# Altium schematic sheet 0062_DG2 DISPLAY - HDMI.SchDoc
size 848 x 558 mm
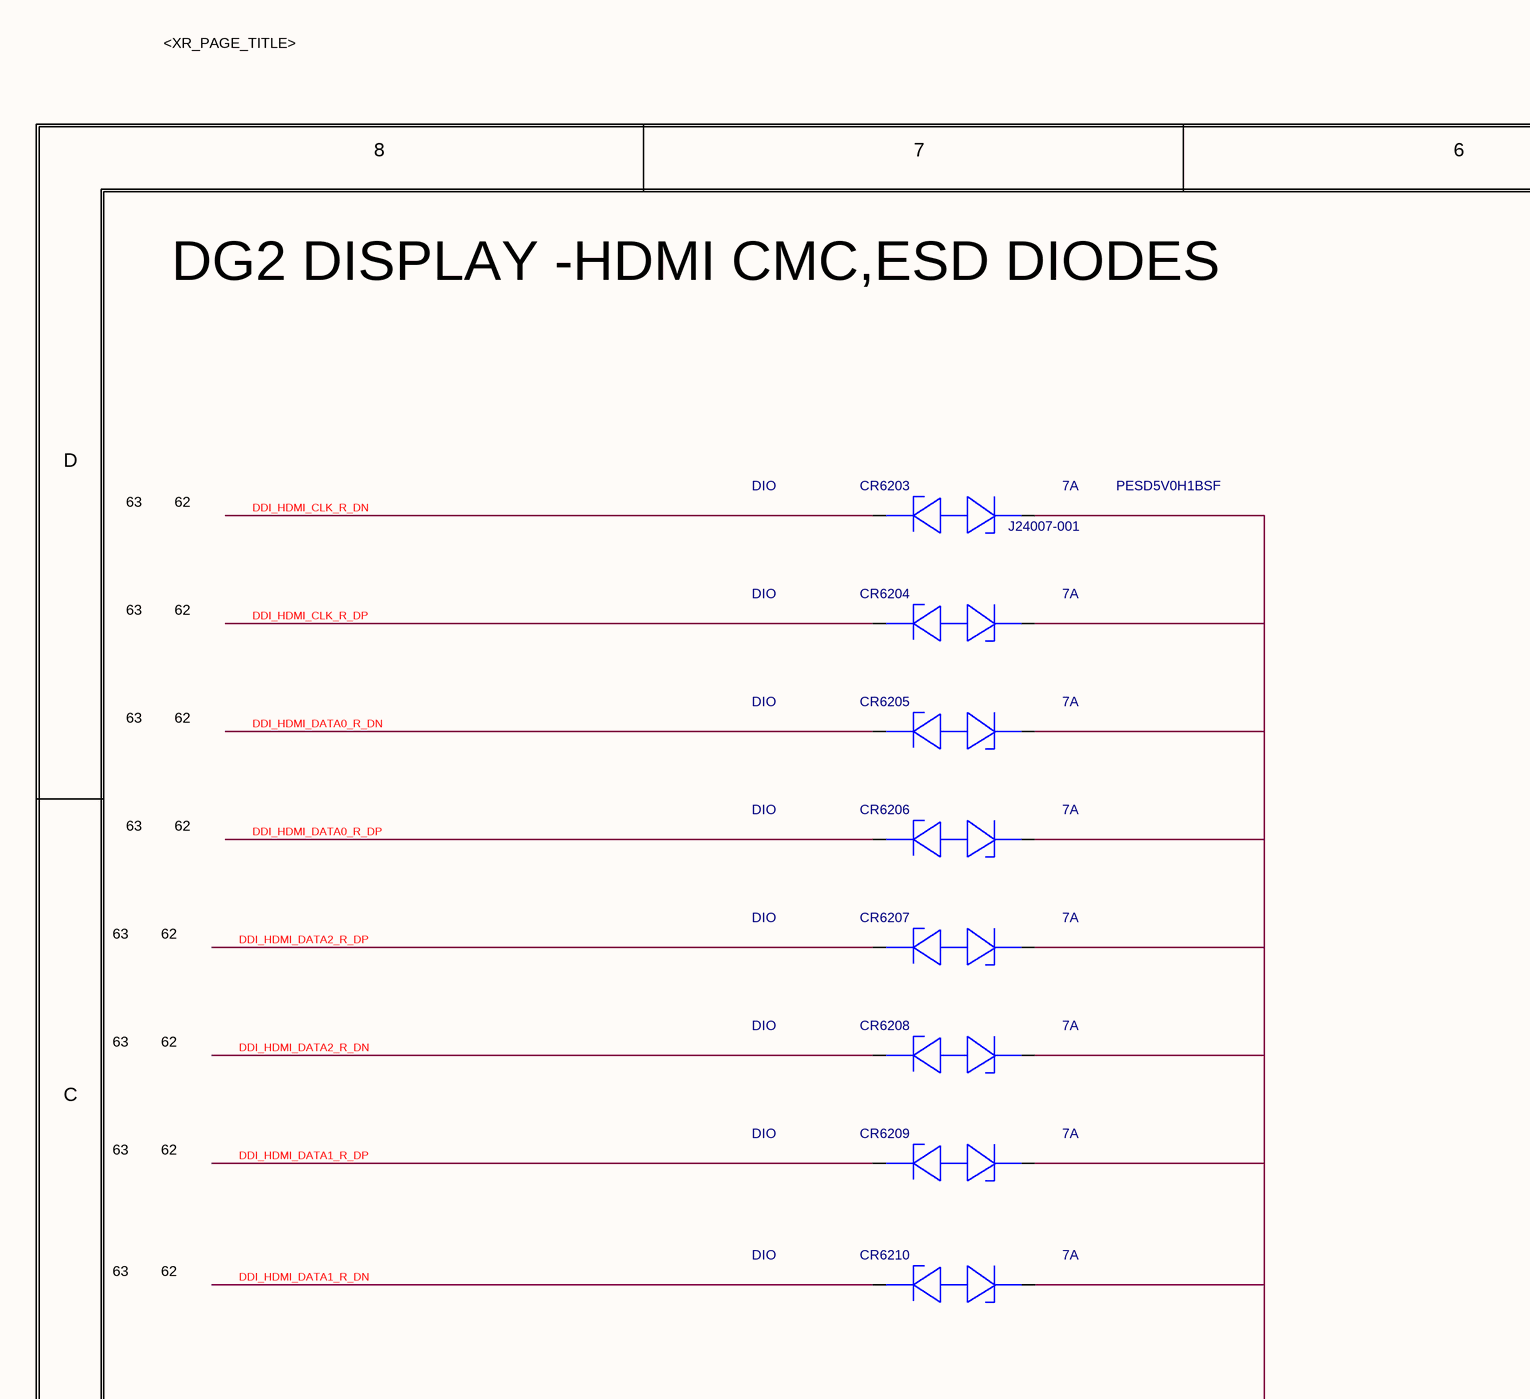
[diagram p0: 0062_DG2 DISPLAY - HDMI.SchDoc, top left]
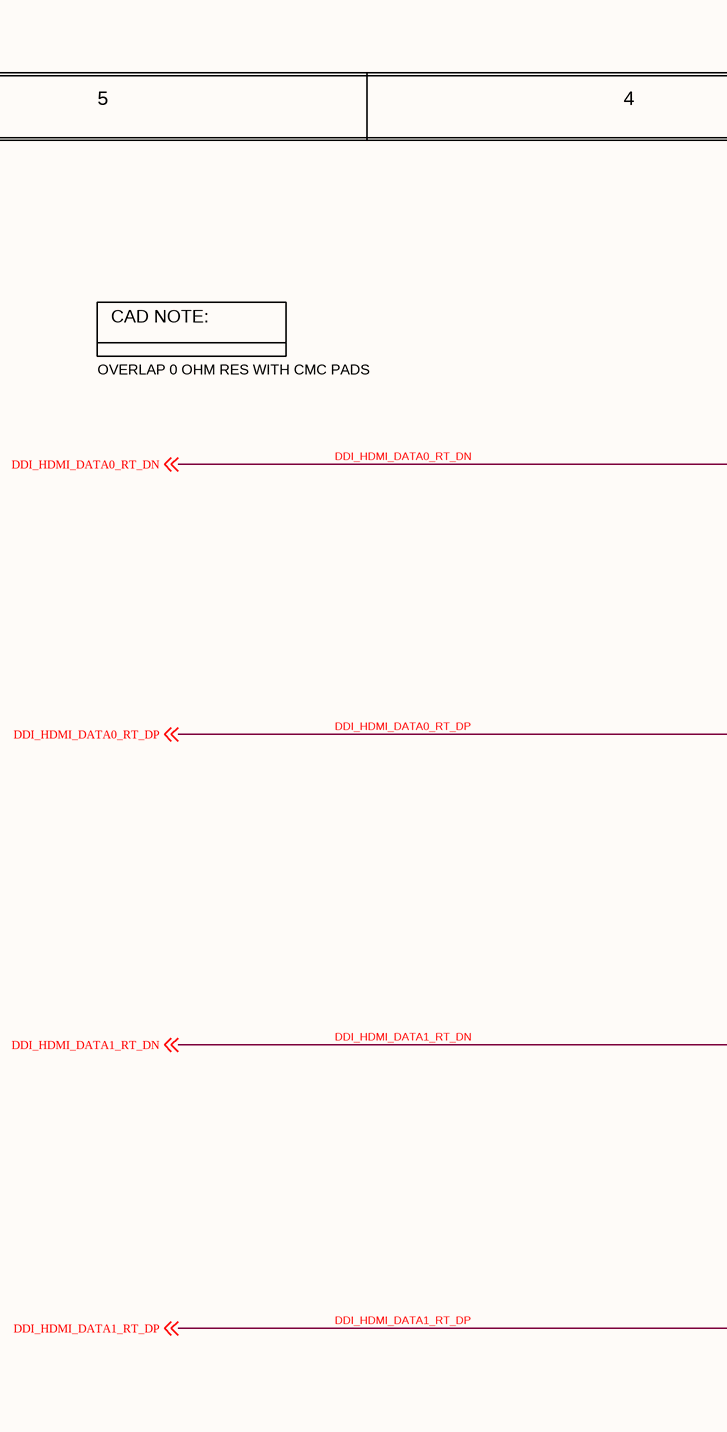
[diagram p1: 0062_DG2 DISPLAY - HDMI.SchDoc, top middle]
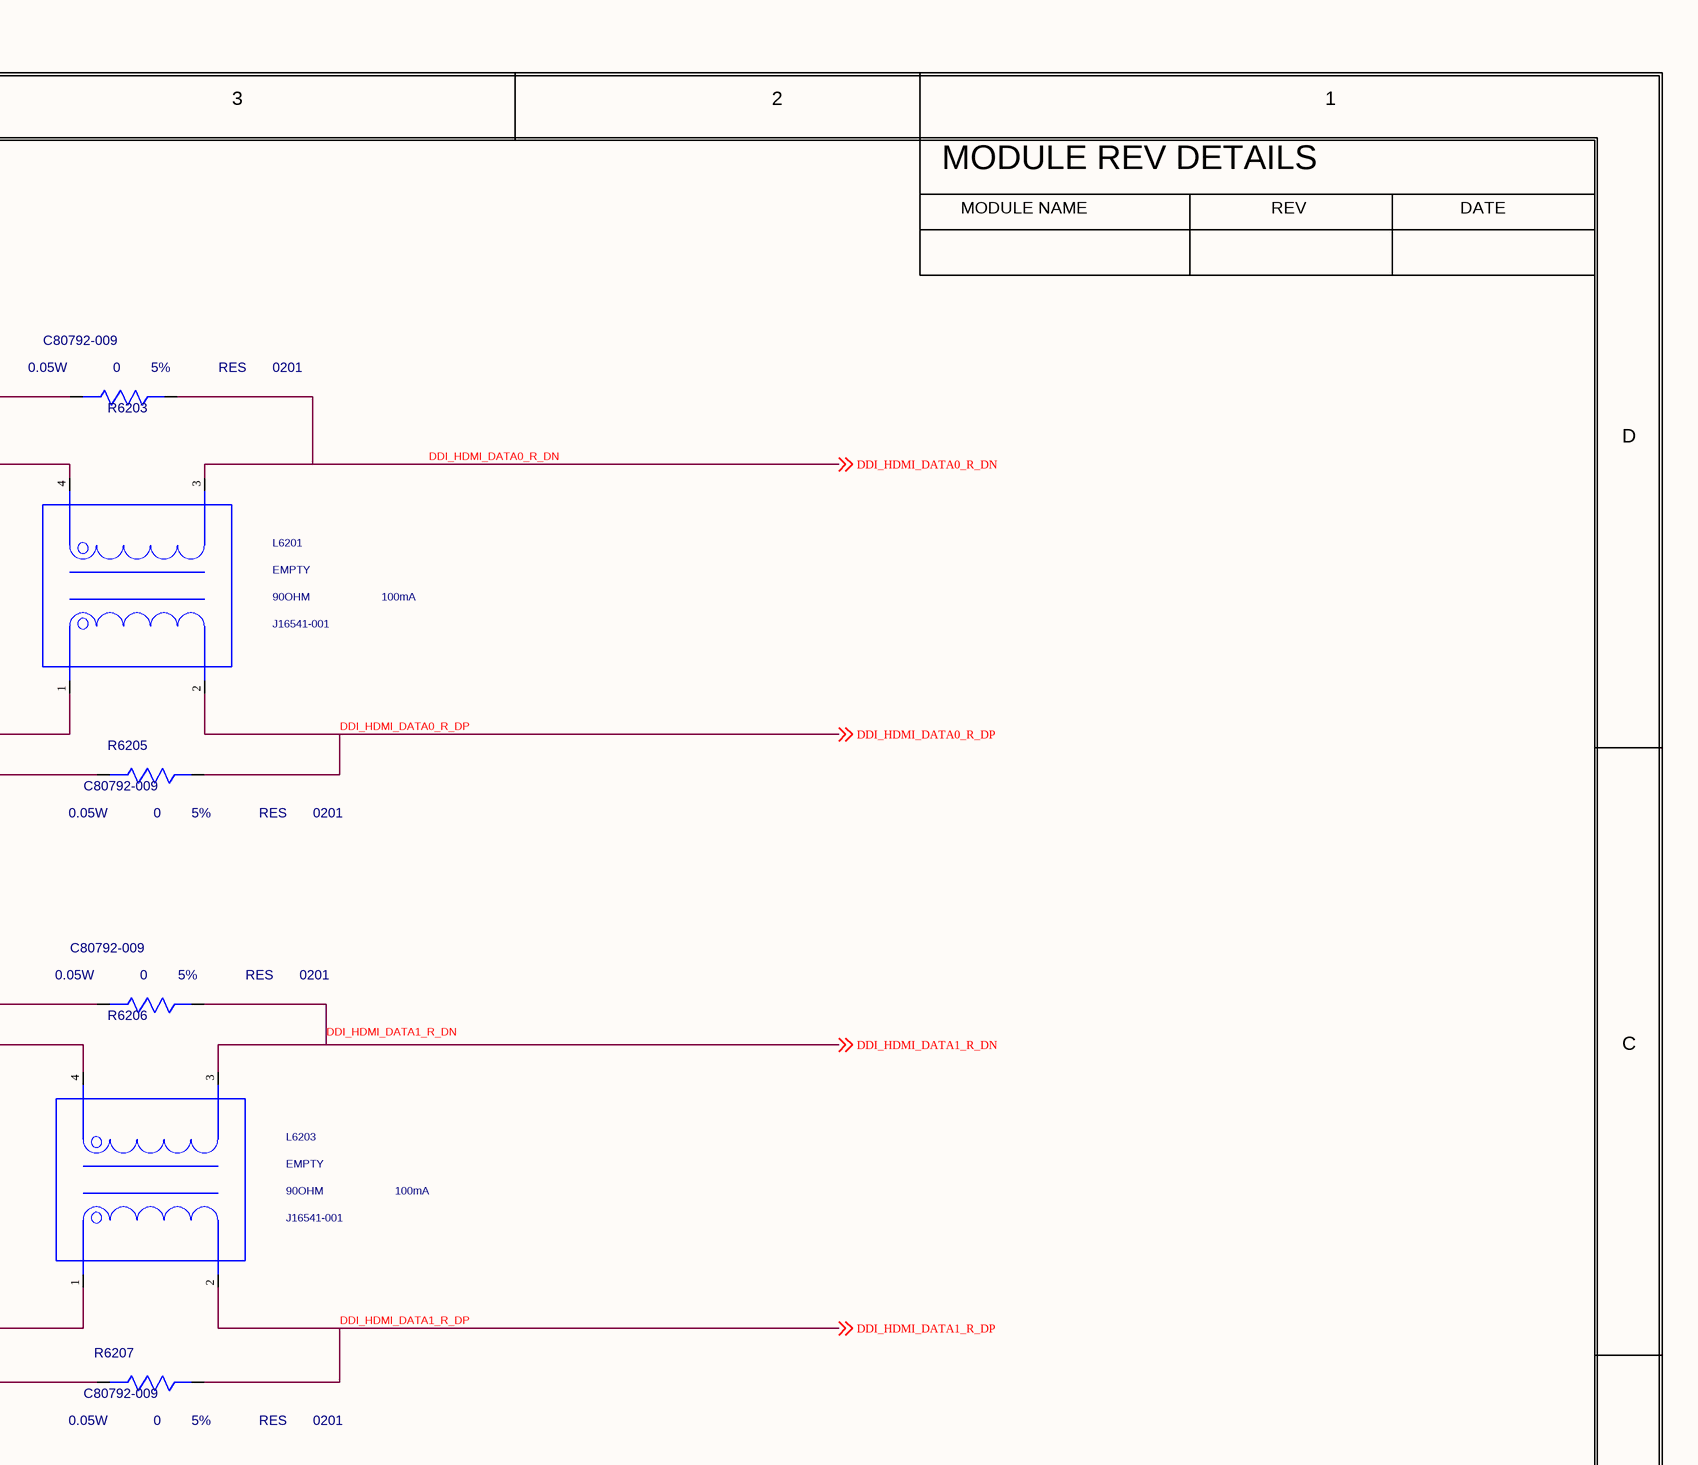
[diagram p2: 0062_DG2 DISPLAY - HDMI.SchDoc, top right]
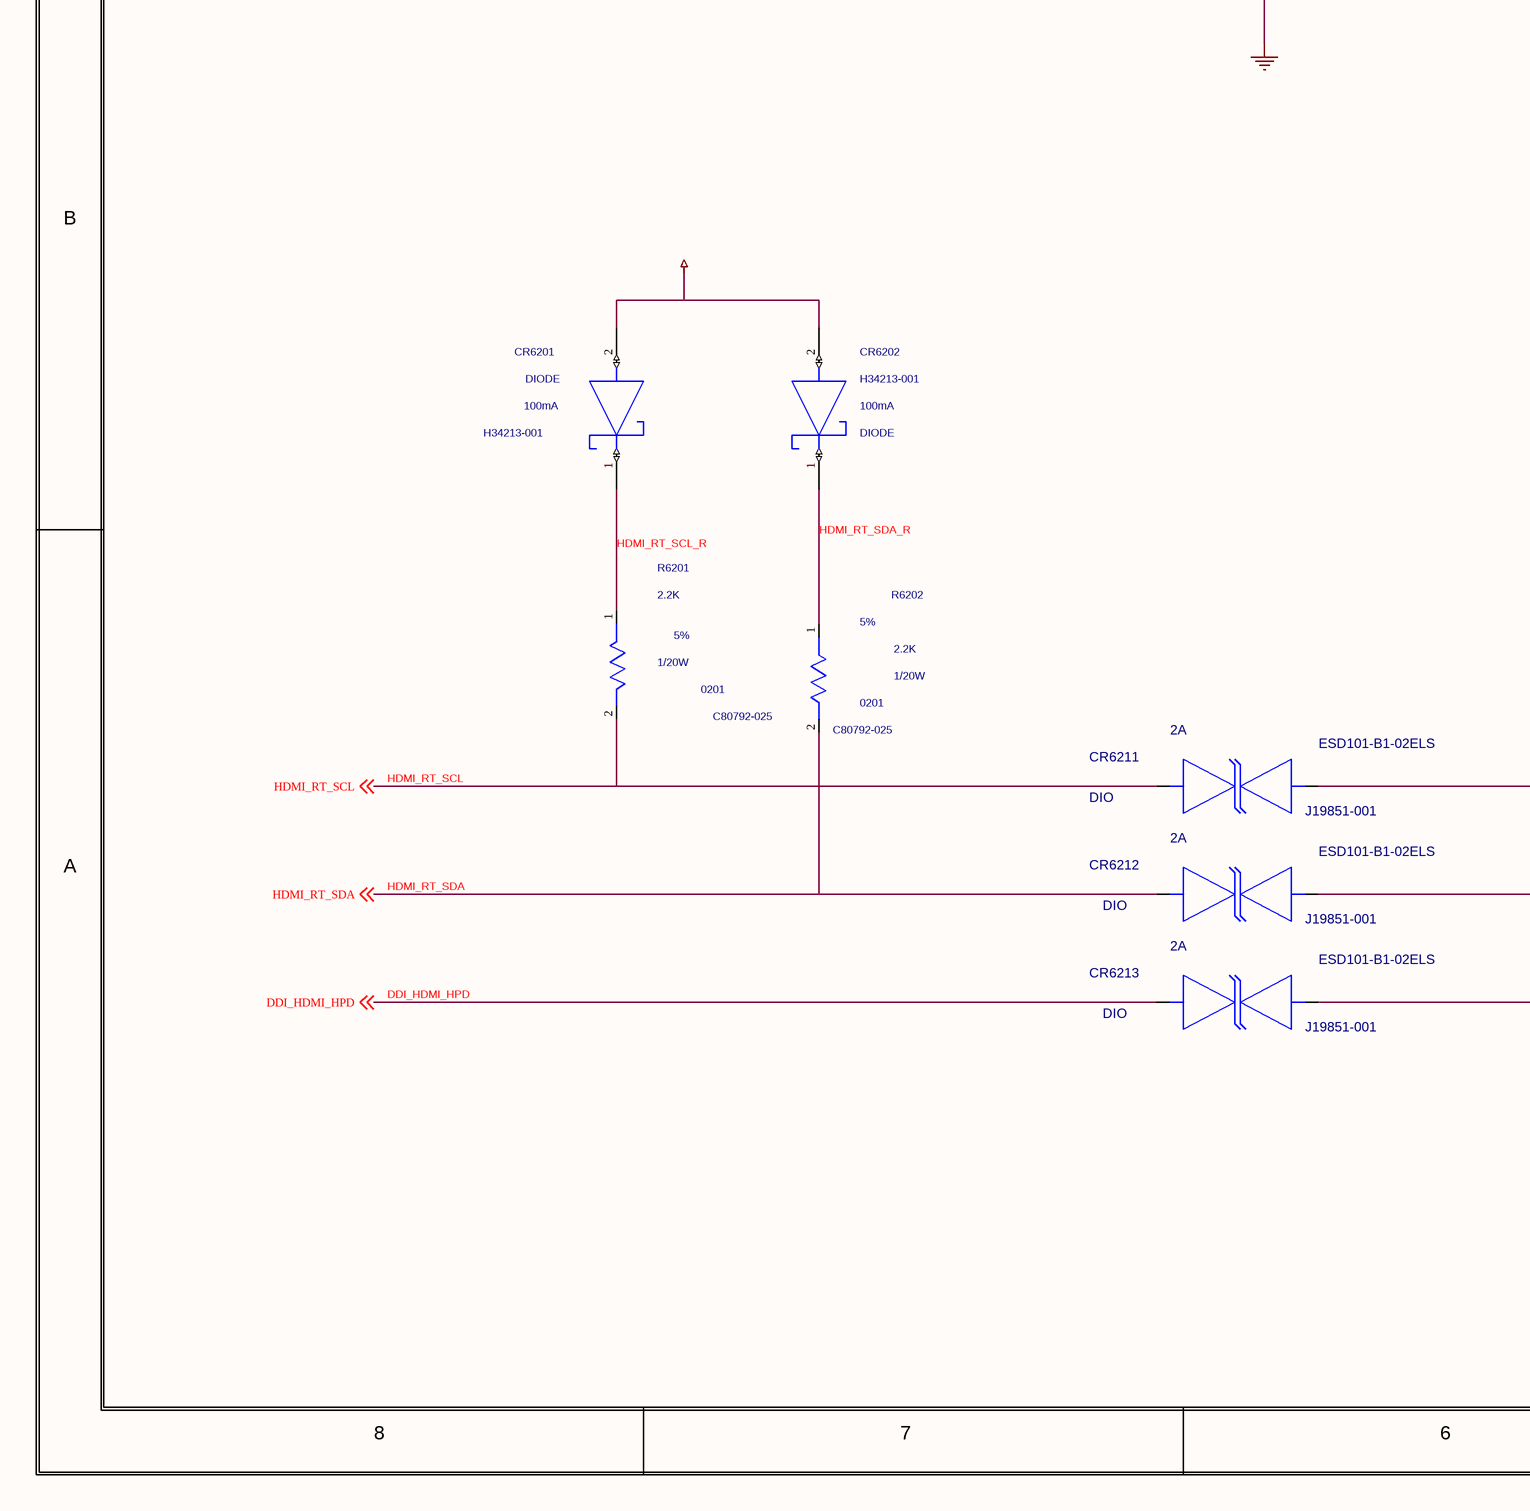
[diagram p3: 0062_DG2 DISPLAY - HDMI.SchDoc, bottom left]
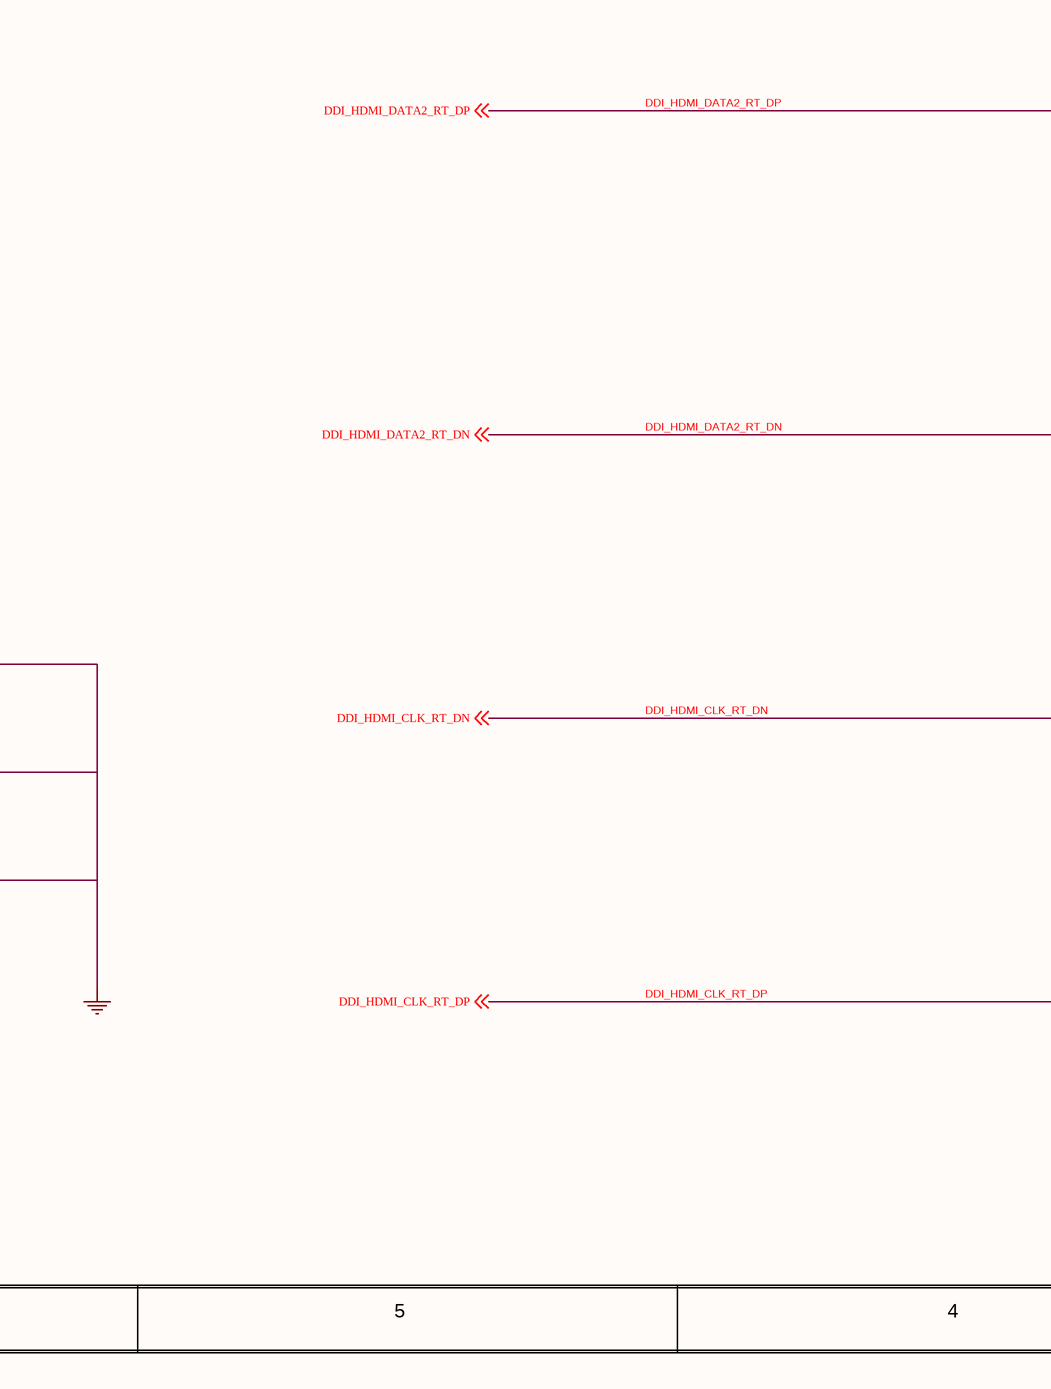
[diagram p4: 0062_DG2 DISPLAY - HDMI.SchDoc, bottom middle]
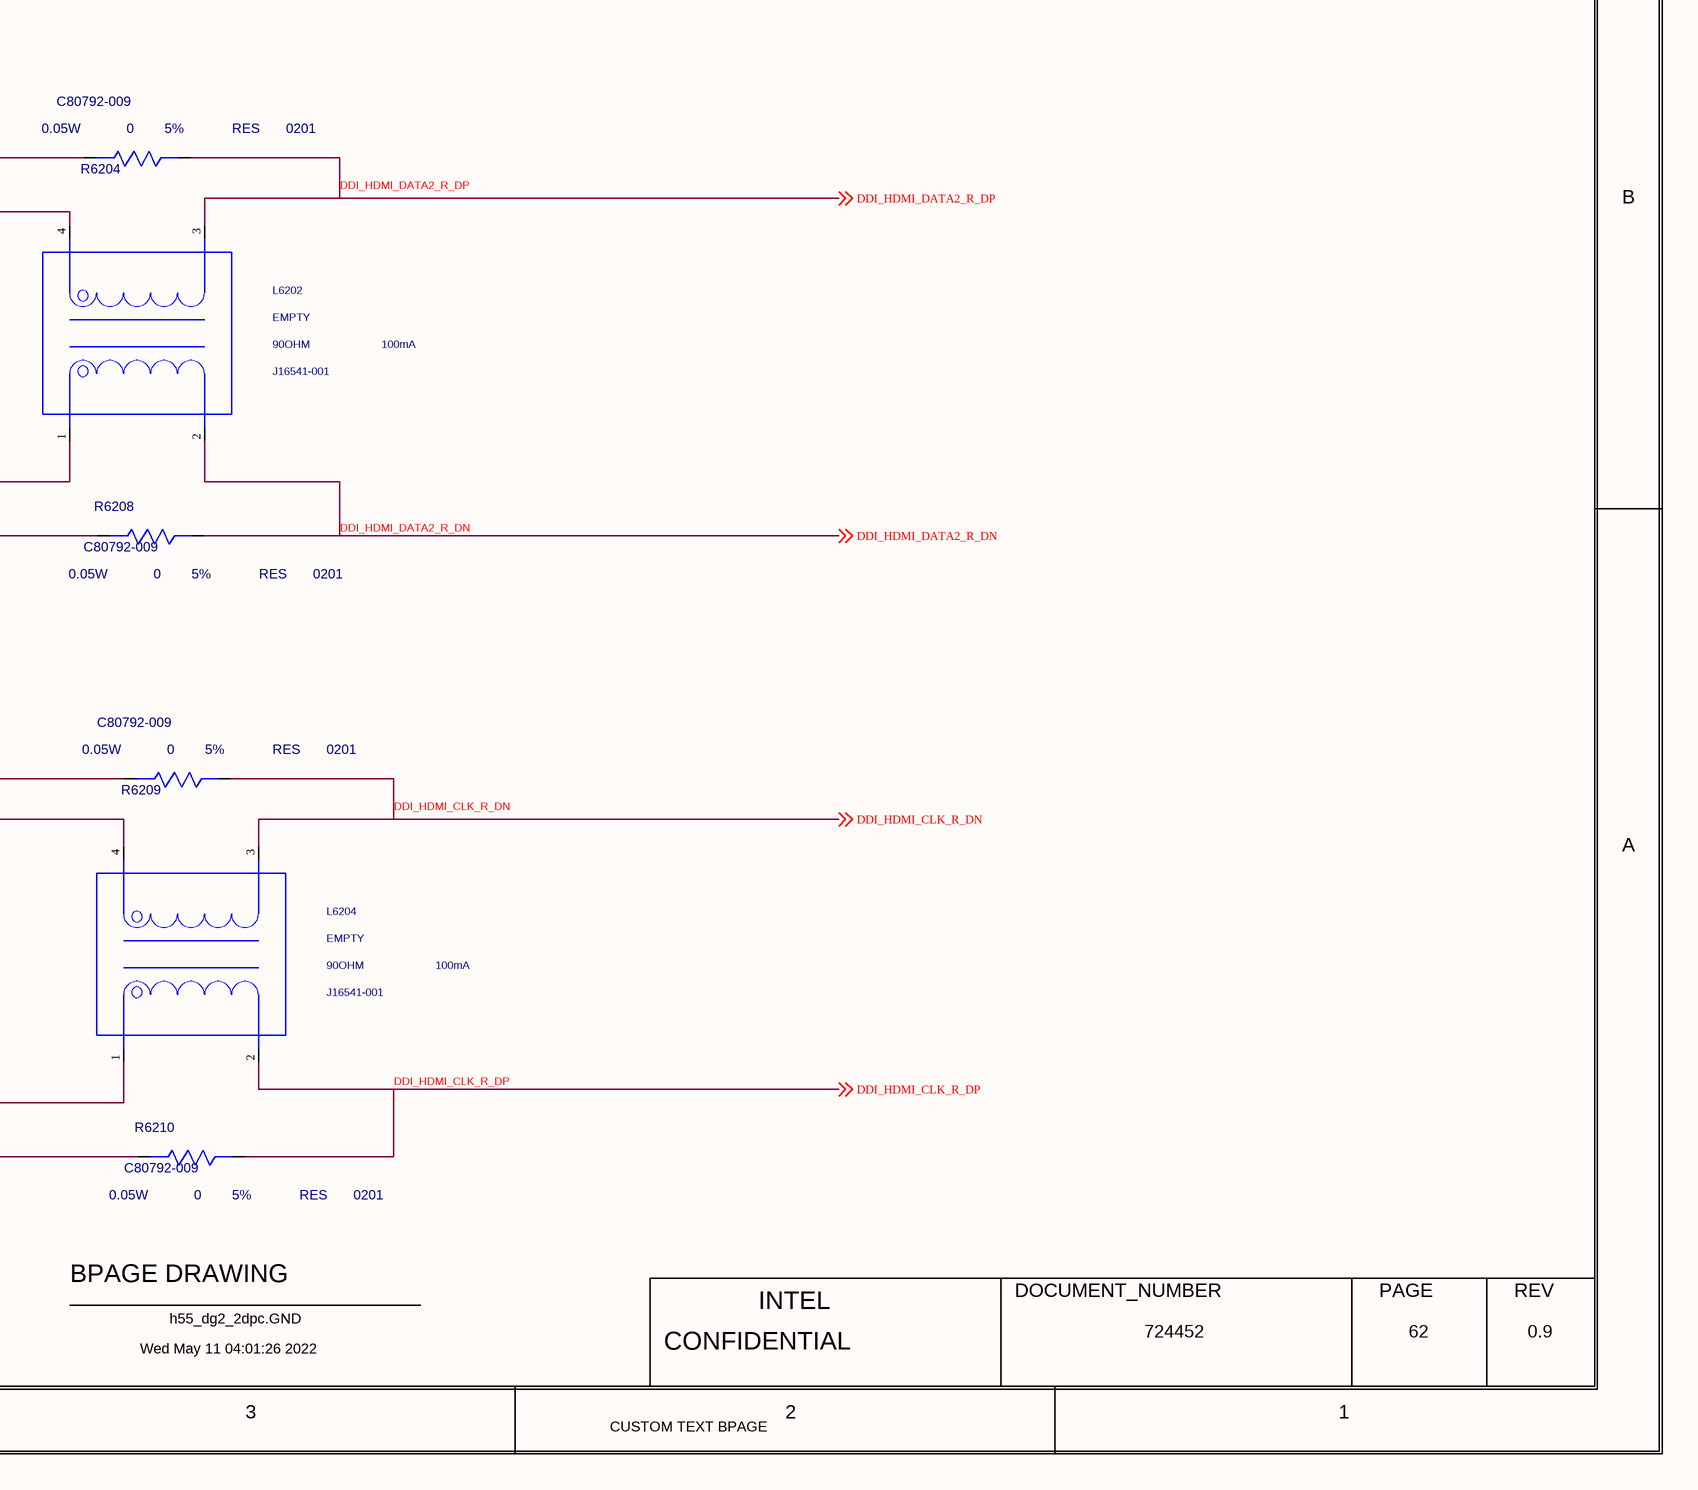
[diagram p5: 0062_DG2 DISPLAY - HDMI.SchDoc, bottom right]

## Parts
CR6201  CURRENT: 100mA  MATERIAL: DIODE  PART_NUMBER: H34213-001  [SOD923MA]  (hidden comment: RB521C30-2/TR)
CR6202  CURRENT: 100mA  MATERIAL: DIODE  PART_NUMBER: H34213-001  [SOD923MA]  (hidden comment: RB521C30-2/TR)
CR6203  PESD5V0H1BSF  CURRENT: 7A  MATERIAL: DIO  PART_NUMBER: J24007-001  [CTK1_SCR_625X325_MA]
CR6204  CURRENT: 7A  MATERIAL: DIO  [CTK1_SCR_625X325_MA]  (hidden comment: PESD5V0H1BSF)
CR6205  CURRENT: 7A  MATERIAL: DIO  [CTK1_SCR_625X325_MA]  (hidden comment: PESD5V0H1BSF)
CR6206  CURRENT: 7A  MATERIAL: DIO  [CTK1_SCR_625X325_MA]  (hidden comment: PESD5V0H1BSF)
CR6207  CURRENT: 7A  MATERIAL: DIO  [CTK1_SCR_625X325_MA]  (hidden comment: PESD5V0H1BSF)
CR6208  CURRENT: 7A  MATERIAL: DIO  [CTK1_SCR_625X325_MA]  (hidden comment: PESD5V0H1BSF)
CR6209  CURRENT: 7A  MATERIAL: DIO  [CTK1_SCR_625X325_MA]  (hidden comment: PESD5V0H1BSF)
CR6210  CURRENT: 7A  MATERIAL: DIO  [CTK1_SCR_625X325_MA]  (hidden comment: PESD5V0H1BSF)
CR6211  ESD101-B1-02ELS  CURRENT: 2A  MATERIAL: DIO  PART_NUMBER: J19851-001  [CTK2_SCR0201_670X370_MB]
CR6212  ESD101-B1-02ELS  CURRENT: 2A  MATERIAL: DIO  PART_NUMBER: J19851-001  [CTK2_SCR0201_670X370_MB]
CR6213  ESD101-B1-02ELS  CURRENT: 2A  MATERIAL: DIO  PART_NUMBER: J19851-001  [CTK2_SCR0201_670X370_MB]
L6201  90OHM  CURRENT: 100mA  MATERIAL: EMPTY  PART_NUMBER: J16541-001  [SMI4_50X65MA]
L6202  90OHM  CURRENT: 100mA  MATERIAL: EMPTY  PART_NUMBER: J16541-001  [SMI4_50X65MA]
L6203  90OHM  CURRENT: 100mA  MATERIAL: EMPTY  PART_NUMBER: J16541-001  [SMI4_50X65MA]
L6204  90OHM  CURRENT: 100mA  MATERIAL: EMPTY  PART_NUMBER: J16541-001  [SMI4_50X65MA]
R6201  2.2K  PACK_TYPE: 0201  PART_NUMBER: C80792-025  TOLERANCE: 5%  WATTAGE: 1/20W  [SMR0201IA]
R6202  2.2K  PACK_TYPE: 0201  PART_NUMBER: C80792-025  TOLERANCE: 5%  WATTAGE: 1/20W  [SMR0201IA]
R6203  0  MATERIAL: RES  PACK_TYPE: 0201  PART_NUMBER: C80792-009  TOLERANCE: 5%  WATTAGE: 0.05W  [CTK0_SM0201_630X330_MA]
R6204  0  MATERIAL: RES  PACK_TYPE: 0201  PART_NUMBER: C80792-009  TOLERANCE: 5%  WATTAGE: 0.05W  [CTK0_SM0201_630X330_MA]
R6205  0  MATERIAL: RES  PACK_TYPE: 0201  PART_NUMBER: C80792-009  TOLERANCE: 5%  WATTAGE: 0.05W  [CTK0_SM0201_630X330_MA]
R6206  0  MATERIAL: RES  PACK_TYPE: 0201  PART_NUMBER: C80792-009  TOLERANCE: 5%  WATTAGE: 0.05W  [CTK0_SM0201_630X330_MA]
R6207  0  MATERIAL: RES  PACK_TYPE: 0201  PART_NUMBER: C80792-009  TOLERANCE: 5%  WATTAGE: 0.05W  [CTK0_SM0201_630X330_MA]
R6208  0  MATERIAL: RES  PACK_TYPE: 0201  PART_NUMBER: C80792-009  TOLERANCE: 5%  WATTAGE: 0.05W  [CTK0_SM0201_630X330_MA]
R6209  0  MATERIAL: RES  PACK_TYPE: 0201  PART_NUMBER: C80792-009  TOLERANCE: 5%  WATTAGE: 0.05W  [CTK0_SM0201_630X330_MA]
R6210  0  MATERIAL: RES  PACK_TYPE: 0201  PART_NUMBER: C80792-009  TOLERANCE: 5%  WATTAGE: 0.05W  [CTK0_SM0201_630X330_MA]

## Nets
+V5A_HDMI_DDIB: CR6201.2(ANODE) CR6202.2(ANODE)
GND: CR6203.2(K2) CR6204.2(K2) CR6205.2(K2) CR6206.2(K2) CR6207.2(K2) CR6208.2(K2) CR6209.2(K2) CR6210.2(K2) CR6211.2(A2) CR6212.2(A2) CR6213.2(A2)
DDI_HDMI_CLK_R_DN: CR6203.1(K1) L6204.3(PIN3) R6209.2(B) ; off-sheet DDI_HDMI_CLK_R_DN
DDI_HDMI_CLK_R_DP: CR6204.1(K1) L6204.2(PIN2) R6210.2(B) ; off-sheet DDI_HDMI_CLK_R_DP
DDI_HDMI_CLK_RT_DN: L6204.4(PIN4) R6209.1(A) ; off-sheet DDI_HDMI_CLK_RT_DN
DDI_HDMI_CLK_RT_DP: L6204.1(PIN1) R6210.1(A) ; off-sheet DDI_HDMI_CLK_RT_DP
DDI_HDMI_DATA0_R_DN: CR6205.1(K1) L6201.3(PIN3) R6203.2(B) ; off-sheet DDI_HDMI_DATA0_R_DN
DDI_HDMI_DATA0_R_DP: CR6206.1(K1) L6201.2(PIN2) R6205.2(B) ; off-sheet DDI_HDMI_DATA0_R_DP
DDI_HDMI_DATA0_RT_DN: L6201.4(PIN4) R6203.1(A) ; off-sheet DDI_HDMI_DATA0_RT_DN
DDI_HDMI_DATA0_RT_DP: L6201.1(PIN1) R6205.1(A) ; off-sheet DDI_HDMI_DATA0_RT_DP
DDI_HDMI_DATA1_R_DN: CR6210.1(K1) L6203.3(PIN3) R6206.2(B) ; off-sheet DDI_HDMI_DATA1_R_DN
DDI_HDMI_DATA1_R_DP: CR6209.1(K1) L6203.2(PIN2) R6207.2(B) ; off-sheet DDI_HDMI_DATA1_R_DP
DDI_HDMI_DATA1_RT_DN: L6203.4(PIN4) R6206.1(A) ; off-sheet DDI_HDMI_DATA1_RT_DN
DDI_HDMI_DATA1_RT_DP: L6203.1(PIN1) R6207.1(A) ; off-sheet DDI_HDMI_DATA1_RT_DP
DDI_HDMI_DATA2_R_DN: CR6208.1(K1) L6202.2(PIN2) R6208.2(B) ; off-sheet DDI_HDMI_DATA2_R_DN
DDI_HDMI_DATA2_R_DP: CR6207.1(K1) L6202.3(PIN3) R6204.2(B) ; off-sheet DDI_HDMI_DATA2_R_DP
DDI_HDMI_DATA2_RT_DN: L6202.1(PIN1) R6208.1(A) ; off-sheet DDI_HDMI_DATA2_RT_DN
DDI_HDMI_DATA2_RT_DP: L6202.4(PIN4) R6204.1(A) ; off-sheet DDI_HDMI_DATA2_RT_DP
DDI_HDMI_HPD: CR6213.1(A1) ; off-sheet DDI_HDMI_HPD
HDMI_RT_SCL: CR6211.1(A1) R6201.2(B) ; off-sheet HDMI_RT_SCL
HDMI_RT_SCL_R: CR6201.1(CATHODE) R6201.1(A)
HDMI_RT_SDA: CR6212.1(A1) R6202.2(B) ; off-sheet HDMI_RT_SDA
HDMI_RT_SDA_R: CR6202.1(CATHODE) R6202.1(A)

## Notes on the sheet
- <XR_PAGE_TITLE>
- 8
- 7
- 6
- 5
- 4
- 3
- 2
- 1
- MODULE REV DETAILS
- DG2 DISPLAY -HDMI CMC,ESD DIODES
- MODULE NAME
- REV
- DATE
- CAD NOTE:
- OVERLAP 0 OHM RES WITH CMC PADS
- D
- 63
- 62
- C
- B
- A
- BPAGE DRAWING
- INTEL
- DOCUMENT_NUMBER
- PAGE
- Wed May 11 04:01:26 2022
- h55_dg2_2dpc.GND
- CONFIDENTIAL
- 724452
- 0.9
- CUSTOM TEXT BPAGE

## Library data of the parts
CR6201 = DIODE_SCHOTTKY: CDS_PHYS_PART_NAME: DIODE_SCHOTTKY_SM-H34213-001,DIODE,RB521C30-2/TR,100MA,LPDB,GENA; CDS_LMAN_SYM_OUTLINE: -50,100,50,-100; PACK_TYPE: SM; OriginalSymbolOrigin: (-75,50); XY: (-3300,1225); VER: 1; SUITE: ADL; SUB_ROOM: HDMI_DISCRETES; ROT: 3; ROOM1: HDMI; PHYS_PAGE: 62; LOCATION: CR6201; IP: GENERIC; FP_TECH: LPDB; DRAWING: @RVP1_ADL_SB_ADP_S_DDR5_SODIMM_2DPC_LIB.H55_DG2_2DPC(SCH_1):PAGE62; CONFIG: GENERAL; CDS_LIB: discrete; PCB Footprint: SOD923MA; CHIPS_PART_NAME: DIODE_SCHOTTKY; CDS_PART_NAME: DIODE_SCHOTTKY_SM-H34213-001,DIODE,RB521C30-2/TR,100MA,LPDB,GENA; CDS_LOCATION: CR6201
CR6202 = DIODE_SCHOTTKY: CDS_PHYS_PART_NAME: DIODE_SCHOTTKY_SM-H34213-001,DIODE,RB521C30-2/TR,100MA,LPDB,GENA; CDS_LMAN_SYM_OUTLINE: -50,100,50,-100; PACK_TYPE: SM; OriginalSymbolOrigin: (-75,50); XY: (-2925,1225); VER: 1; SUITE: ADL; SUB_ROOM: HDMI_DISCRETES; ROT: 3; ROOM1: HDMI; PHYS_PAGE: 62; LOCATION: CR6202; IP: GENERIC; FP_TECH: LPDB; DRAWING: @RVP1_ADL_SB_ADP_S_DDR5_SODIMM_2DPC_LIB.H55_DG2_2DPC(SCH_1):PAGE62; CONFIG: GENERAL; CDS_LIB: discrete; PCB Footprint: SOD923MA; CHIPS_PART_NAME: DIODE_SCHOTTKY; CDS_PART_NAME: DIODE_SCHOTTKY_SM-H34213-001,DIODE,RB521C30-2/TR,100MA,LPDB,GENA; CDS_LOCATION: CR6202
CR6203 = C_DIODE_ESD_BIDIR: CDS_PHYS_PART_NAME: C_DIODE_ESD_BIDIR_SM-J24007-001,DIO,PESD5V0H1BSF,7A,TK1,GENERIC; CDS_LMAN_SYM_OUTLINE: -100,50,100,-50; FP_TECH: TK1; IP: GENERIC; PACK_TYPE: SM; ROOM: NONE; OriginalSymbolOrigin: (-125,50); XY: (-2675,3775); VER: 1; ROT: 0; PHYS_PAGE: 62; LOCATION: CR6203; DRAWING: @RVP1_ADL_SB_ADP_S_DDR5_SODIMM_2DPC_LIB.H55_DG2_2DPC(SCH_1):PAGE62; CDS_LIB: local; VARIANT: ?; PCB Footprint: CTK1_SCR_625X325_MA; CHIPS_PART_NAME: C_DIODE_ESD_BIDIR; CDS_PART_NAME: C_DIODE_ESD_BIDIR_SM-J24007-001,DIO,PESD5V0H1BSF,7A,TK1,GENERIC; CDS_LOCATION: CR6203
CR6204 = C_DIODE_ESD_BIDIR: PART_NUMBER: J24007-001; CDS_PHYS_PART_NAME: C_DIODE_ESD_BIDIR_SM-J24007-001,DIO,PESD5V0H1BSF,7A,TK1,GENERIC; CDS_LMAN_SYM_OUTLINE: -100,50,100,-50; FP_TECH: TK1; IP: GENERIC; PACK_TYPE: SM; ROOM: NONE; OriginalSymbolOrigin: (-125,50); XY: (-2675,3575); VER: 1; ROT: 0; PHYS_PAGE: 62; LOCATION: CR6204; DRAWING: @RVP1_ADL_SB_ADP_S_DDR5_SODIMM_2DPC_LIB.H55_DG2_2DPC(SCH_1):PAGE62; CDS_LIB: local; VARIANT: ?; PCB Footprint: CTK1_SCR_625X325_MA; CHIPS_PART_NAME: C_DIODE_ESD_BIDIR; CDS_PART_NAME: C_DIODE_ESD_BIDIR_SM-J24007-001,DIO,PESD5V0H1BSF,7A,TK1,GENERIC; CDS_LOCATION: CR6204
CR6205 = C_DIODE_ESD_BIDIR: PART_NUMBER: J24007-001; CDS_PHYS_PART_NAME: C_DIODE_ESD_BIDIR_SM-J24007-001,DIO,PESD5V0H1BSF,7A,TK1,GENERIC; CDS_LMAN_SYM_OUTLINE: -100,50,100,-50; FP_TECH: TK1; IP: GENERIC; PACK_TYPE: SM; ROOM: NONE; OriginalSymbolOrigin: (-125,50); XY: (-2675,3375); VER: 1; ROT: 0; PHYS_PAGE: 62; LOCATION: CR6205; DRAWING: @RVP1_ADL_SB_ADP_S_DDR5_SODIMM_2DPC_LIB.H55_DG2_2DPC(SCH_1):PAGE62; CDS_LIB: local; VARIANT: ?; PCB Footprint: CTK1_SCR_625X325_MA; CHIPS_PART_NAME: C_DIODE_ESD_BIDIR; CDS_PART_NAME: C_DIODE_ESD_BIDIR_SM-J24007-001,DIO,PESD5V0H1BSF,7A,TK1,GENERIC; CDS_LOCATION: CR6205
CR6206 = C_DIODE_ESD_BIDIR: PART_NUMBER: J24007-001; CDS_PHYS_PART_NAME: C_DIODE_ESD_BIDIR_SM-J24007-001,DIO,PESD5V0H1BSF,7A,TK1,GENERIC; CDS_LMAN_SYM_OUTLINE: -100,50,100,-50; FP_TECH: TK1; IP: GENERIC; PACK_TYPE: SM; ROOM: NONE; OriginalSymbolOrigin: (-125,50); XY: (-2675,3175); VER: 1; ROT: 0; PHYS_PAGE: 62; LOCATION: CR6206; DRAWING: @RVP1_ADL_SB_ADP_S_DDR5_SODIMM_2DPC_LIB.H55_DG2_2DPC(SCH_1):PAGE62; CDS_LIB: local; VARIANT: ?; PCB Footprint: CTK1_SCR_625X325_MA; CHIPS_PART_NAME: C_DIODE_ESD_BIDIR; CDS_PART_NAME: C_DIODE_ESD_BIDIR_SM-J24007-001,DIO,PESD5V0H1BSF,7A,TK1,GENERIC; CDS_LOCATION: CR6206
CR6207 = C_DIODE_ESD_BIDIR: PART_NUMBER: J24007-001; CDS_PHYS_PART_NAME: C_DIODE_ESD_BIDIR_SM-J24007-001,DIO,PESD5V0H1BSF,7A,TK1,GENERIC; CDS_LMAN_SYM_OUTLINE: -100,50,100,-50; FP_TECH: TK1; IP: GENERIC; PACK_TYPE: SM; ROOM: NONE; OriginalSymbolOrigin: (-125,50); XY: (-2675,2975); VER: 1; ROT: 0; PHYS_PAGE: 62; LOCATION: CR6207; DRAWING: @RVP1_ADL_SB_ADP_S_DDR5_SODIMM_2DPC_LIB.H55_DG2_2DPC(SCH_1):PAGE62; CDS_LIB: local; VARIANT: ?; PCB Footprint: CTK1_SCR_625X325_MA; CHIPS_PART_NAME: C_DIODE_ESD_BIDIR; CDS_PART_NAME: C_DIODE_ESD_BIDIR_SM-J24007-001,DIO,PESD5V0H1BSF,7A,TK1,GENERIC; CDS_LOCATION: CR6207
CR6208 = C_DIODE_ESD_BIDIR: PART_NUMBER: J24007-001; CDS_PHYS_PART_NAME: C_DIODE_ESD_BIDIR_SM-J24007-001,DIO,PESD5V0H1BSF,7A,TK1,GENERIC; CDS_LMAN_SYM_OUTLINE: -100,50,100,-50; FP_TECH: TK1; IP: GENERIC; PACK_TYPE: SM; ROOM: NONE; OriginalSymbolOrigin: (-125,50); XY: (-2675,2775); VER: 1; ROT: 0; PHYS_PAGE: 62; LOCATION: CR6208; DRAWING: @RVP1_ADL_SB_ADP_S_DDR5_SODIMM_2DPC_LIB.H55_DG2_2DPC(SCH_1):PAGE62; CDS_LIB: local; VARIANT: ?; PCB Footprint: CTK1_SCR_625X325_MA; CHIPS_PART_NAME: C_DIODE_ESD_BIDIR; CDS_PART_NAME: C_DIODE_ESD_BIDIR_SM-J24007-001,DIO,PESD5V0H1BSF,7A,TK1,GENERIC; CDS_LOCATION: CR6208
CR6209 = C_DIODE_ESD_BIDIR: PART_NUMBER: J24007-001; CDS_PHYS_PART_NAME: C_DIODE_ESD_BIDIR_SM-J24007-001,DIO,PESD5V0H1BSF,7A,TK1,GENERIC; CDS_LMAN_SYM_OUTLINE: -100,50,100,-50; FP_TECH: TK1; IP: GENERIC; PACK_TYPE: SM; ROOM: NONE; OriginalSymbolOrigin: (-125,50); XY: (-2675,2575); VER: 1; ROT: 0; PHYS_PAGE: 62; LOCATION: CR6209; DRAWING: @RVP1_ADL_SB_ADP_S_DDR5_SODIMM_2DPC_LIB.H55_DG2_2DPC(SCH_1):PAGE62; CDS_LIB: local; VARIANT: ?; PCB Footprint: CTK1_SCR_625X325_MA; CHIPS_PART_NAME: C_DIODE_ESD_BIDIR; CDS_PART_NAME: C_DIODE_ESD_BIDIR_SM-J24007-001,DIO,PESD5V0H1BSF,7A,TK1,GENERIC; CDS_LOCATION: CR6209
CR6210 = C_DIODE_ESD_BIDIR: PART_NUMBER: J24007-001; CDS_PHYS_PART_NAME: C_DIODE_ESD_BIDIR_SM-J24007-001,DIO,PESD5V0H1BSF,7A,TK1,GENERIC; CDS_LMAN_SYM_OUTLINE: -100,50,100,-50; FP_TECH: TK1; IP: GENERIC; PACK_TYPE: SM; ROOM: NONE; OriginalSymbolOrigin: (-125,50); XY: (-2675,2350); VER: 1; ROT: 0; PHYS_PAGE: 62; LOCATION: CR6210; DRAWING: @RVP1_ADL_SB_ADP_S_DDR5_SODIMM_2DPC_LIB.H55_DG2_2DPC(SCH_1):PAGE62; CDS_LIB: local; VARIANT: ?; PCB Footprint: CTK1_SCR_625X325_MA; CHIPS_PART_NAME: C_DIODE_ESD_BIDIR; CDS_PART_NAME: C_DIODE_ESD_BIDIR_SM-J24007-001,DIO,PESD5V0H1BSF,7A,TK1,GENERIC; CDS_LOCATION: CR6210
CR6211 = C_DIODE_TVS: CDS_PHYS_PART_NAME: C_DIODE_TVS_SM-J19851-001,DIO,ESD101-B1-02ELS,2A,TK2,GENERIC; CDS_LMAN_SYM_OUTLINE: -100,50,100,-50; FP_TECH: TK2; IP: GENERIC; PACK_TYPE: SM; ROOM: NONE; OriginalSymbolOrigin: (-125,50); XY: (-2150,525); VER: 1; ROT: 0; PHYS_PAGE: 62; LOCATION: CR6211; DRAWING: @RVP1_ADL_SB_ADP_S_DDR5_SODIMM_2DPC_LIB.H55_DG2_2DPC(SCH_1):PAGE62; CDS_LIB: local; VARIANT: ?; PCB Footprint: CTK2_SCR0201_670X370_MB; CHIPS_PART_NAME: C_DIODE_TVS; CDS_PART_NAME: C_DIODE_TVS_SM-J19851-001,DIO,ESD101-B1-02ELS,2A,TK2,GENERIC; CDS_LOCATION: CR6211
CR6212 = C_DIODE_TVS: CDS_PHYS_PART_NAME: C_DIODE_TVS_SM-J19851-001,DIO,ESD101-B1-02ELS,2A,TK2,GENERIC; CDS_LMAN_SYM_OUTLINE: -100,50,100,-50; FP_TECH: TK2; IP: GENERIC; PACK_TYPE: SM; ROOM: NONE; OriginalSymbolOrigin: (-125,50); XY: (-2150,325); VER: 1; ROT: 0; PHYS_PAGE: 62; LOCATION: CR6212; DRAWING: @RVP1_ADL_SB_ADP_S_DDR5_SODIMM_2DPC_LIB.H55_DG2_2DPC(SCH_1):PAGE62; CDS_LIB: local; VARIANT: ?; PCB Footprint: CTK2_SCR0201_670X370_MB; CHIPS_PART_NAME: C_DIODE_TVS; CDS_PART_NAME: C_DIODE_TVS_SM-J19851-001,DIO,ESD101-B1-02ELS,2A,TK2,GENERIC; CDS_LOCATION: CR6212
CR6213 = C_DIODE_TVS: CDS_PHYS_PART_NAME: C_DIODE_TVS_SM-J19851-001,DIO,ESD101-B1-02ELS,2A,TK2,GENERIC; CDS_LMAN_SYM_OUTLINE: -100,50,100,-50; FP_TECH: TK2; IP: GENERIC; PACK_TYPE: SM; ROOM: NONE; OriginalSymbolOrigin: (-125,50); XY: (-2150,125); VER: 1; ROT: 0; PHYS_PAGE: 62; LOCATION: CR6213; DRAWING: @RVP1_ADL_SB_ADP_S_DDR5_SODIMM_2DPC_LIB.H55_DG2_2DPC(SCH_1):PAGE62; CDS_LIB: local; VARIANT: ?; PCB Footprint: CTK2_SCR0201_670X370_MB; CHIPS_PART_NAME: C_DIODE_TVS; CDS_PART_NAME: C_DIODE_TVS_SM-J19851-001,DIO,ESD101-B1-02ELS,2A,TK2,GENERIC; CDS_LOCATION: CR6213
L6201 = CHOKE_4P: CDS_PHYS_PART_NAME: CHOKE_4P_SM3-J16541-001,EMPTY,90OHM,NA,100MA,LPDB,GENERIC; CDS_LMAN_SYM_OUTLINE: -150,200,150,-150; PACK_TYPE: SM3; TOLERANCE: NA; OriginalSymbolOrigin: (-175,200); XY: (1025,3550); VER: 10; SUITE: ADL; SUB_ROOM: HDMI_DISCRETES; ROT: 7; ROOM1: HDMI; PHYS_PAGE: 62; LOCATION: L6201; IP: GENERIC; FP_TECH: LPDB; DRAWING: @RVP1_ADL_SB_ADP_S_DDR5_SODIMM_2DPC_LIB.H55_DG2_2DPC(SCH_1):PAGE62; CONFIG: GENERAL; CDS_LIB: discrete; PCB Footprint: SMI4_50X65MA; CHIPS_PART_NAME: CHOKE_4P; CDS_PART_NAME: CHOKE_4P_SM3-J16541-001,EMPTY,90OHM,NA,100MA,LPDB,GENERIC; CDS_LOCATION: L6201
L6202 = CHOKE_4P: CDS_PHYS_PART_NAME: CHOKE_4P_SM3-J16541-001,EMPTY,90OHM,NA,100MA,LPDB,GENERIC; CDS_LMAN_SYM_OUTLINE: -150,200,150,-150; PACK_TYPE: SM3; TOLERANCE: NA; OriginalSymbolOrigin: (-175,200); XY: (1025,1325); VER: 10; SUITE: ADL; SUB_ROOM: HDMI_DISCRETES; ROT: 7; ROOM1: HDMI; PHYS_PAGE: 62; LOCATION: L6202; IP: GENERIC; FP_TECH: LPDB; DRAWING: @RVP1_ADL_SB_ADP_S_DDR5_SODIMM_2DPC_LIB.H55_DG2_2DPC(SCH_1):PAGE62; CONFIG: GENERAL; CDS_LIB: discrete; PCB Footprint: SMI4_50X65MA; CHIPS_PART_NAME: CHOKE_4P; CDS_PART_NAME: CHOKE_4P_SM3-J16541-001,EMPTY,90OHM,NA,100MA,LPDB,GENERIC; CDS_LOCATION: L6202
L6203 = CHOKE_4P: CDS_PHYS_PART_NAME: CHOKE_4P_SM3-J16541-001,EMPTY,90OHM,NA,100MA,LPDB,GENERIC; CDS_LMAN_SYM_OUTLINE: -150,200,150,-150; PACK_TYPE: SM3; TOLERANCE: NA; OriginalSymbolOrigin: (-175,200); XY: (1050,2450); VER: 10; SUITE: ADL; SUB_ROOM: HDMI_DISCRETES; ROT: 7; ROOM1: HDMI; PHYS_PAGE: 62; LOCATION: L6203; IP: GENERIC; FP_TECH: LPDB; DRAWING: @RVP1_ADL_SB_ADP_S_DDR5_SODIMM_2DPC_LIB.H55_DG2_2DPC(SCH_1):PAGE62; CONFIG: GENERAL; CDS_LIB: discrete; PCB Footprint: SMI4_50X65MA; CHIPS_PART_NAME: CHOKE_4P; CDS_PART_NAME: CHOKE_4P_SM3-J16541-001,EMPTY,90OHM,NA,100MA,LPDB,GENERIC; CDS_LOCATION: L6203
L6204 = CHOKE_4P: CDS_PHYS_PART_NAME: CHOKE_4P_SM3-J16541-001,EMPTY,90OHM,NA,100MA,LPDB,GENERIC; CDS_LMAN_SYM_OUTLINE: -150,200,150,-150; PACK_TYPE: SM3; TOLERANCE: NA; OriginalSymbolOrigin: (-175,200); XY: (1125,175); VER: 10; SUITE: ADL; SUB_ROOM: HDMI_DISCRETES; ROT: 7; ROOM1: HDMI; PHYS_PAGE: 62; LOCATION: L6204; IP: GENERIC; FP_TECH: LPDB; DRAWING: @RVP1_ADL_SB_ADP_S_DDR5_SODIMM_2DPC_LIB.H55_DG2_2DPC(SCH_1):PAGE62; CONFIG: GENERAL; CDS_LIB: discrete; PCB Footprint: SMI4_50X65MA; CHIPS_PART_NAME: CHOKE_4P; CDS_PART_NAME: CHOKE_4P_SM3-J16541-001,EMPTY,90OHM,NA,100MA,LPDB,GENERIC; CDS_LOCATION: L6204
R6201 = RES#1: CHIPS_PART_NAME: RES; CDS_PHYS_PART_NAME: RES_0201-C80792-025,CHIP,2.2K,5%,1/20W,LPDB,GENERIC; OriginalSymbolOrigin: (-75,25); XY: (-3300,750); VER: 1; ROT: 3; PHYS_PAGE: 62; LOCATION: R6201; IP: GENERIC; FP_TECH: LPDB; DRAWING: @RVP1_ADL_SB_ADP_S_DDR5_SODIMM_2DPC_LIB.H55_DG2_2DPC(SCH_1):PAGE62; CDS_LIB: discrete; MATERIAL: CHIP; PCB Footprint: SMR0201IA; SEC_TYPE: 0201; CDS_PART_NAME: RES_0201-C80792-025,CHIP,2.2K,5%,1/20W,LPDB,GENERIC; CDS_LOCATION: R6201
R6202 = RES#1: CHIPS_PART_NAME: RES; CDS_PHYS_PART_NAME: RES_0201-C80792-025,CHIP,2.2K,5%,1/20W,LPDB,GENERIC; OriginalSymbolOrigin: (-75,25); XY: (-2925,725); VER: 1; ROT: 5; PHYS_PAGE: 62; LOCATION: R6202; IP: GENERIC; FP_TECH: LPDB; DRAWING: @RVP1_ADL_SB_ADP_S_DDR5_SODIMM_2DPC_LIB.H55_DG2_2DPC(SCH_1):PAGE62; CDS_LIB: discrete; MATERIAL: CHIP; PCB Footprint: SMR0201IA; SEC_TYPE: 0201; CDS_PART_NAME: RES_0201-C80792-025,CHIP,2.2K,5%,1/20W,LPDB,GENERIC; CDS_LOCATION: R6202
R6203 = C_RES#1: CHIPS_PART_NAME: C_RES; CDS_PHYS_PART_NAME: C_RES_0201-C80792-009,RES,0,5%,0.05W,TK0,GENERIC; CDS_LMAN_SYM_OUTLINE: -50,50,50,-50; FP_TECH: TK0; IP: GENERIC; ROOM: NONE; OriginalSymbolOrigin: (-75,25); XY: (1025,3900); VER: 1; PHYS_PAGE: 62; LOCATION: R6203; DRAWING: @RVP1_ADL_SB_ADP_S_DDR5_SODIMM_2DPC_LIB.H55_DG2_2DPC(SCH_1):PAGE62; CDS_LIB: c_discrete; VARIANT: ?; PCB Footprint: CTK0_SM0201_630X330_MA; ROT: 0; CDS_PART_NAME: C_RES_0201-C80792-009,RES,0,5%,0.05W,TK0,GENERIC; CDS_LOCATION: R6203
R6204 = C_RES#1: CHIPS_PART_NAME: C_RES; CDS_PHYS_PART_NAME: C_RES_0201-C80792-009,RES,0,5%,0.05W,TK0,GENERIC; CDS_LMAN_SYM_OUTLINE: -50,50,50,-50; FP_TECH: TK0; IP: GENERIC; ROOM: NONE; OriginalSymbolOrigin: (-75,25); XY: (1050,1650); VER: 1; PHYS_PAGE: 62; LOCATION: R6204; DRAWING: @RVP1_ADL_SB_ADP_S_DDR5_SODIMM_2DPC_LIB.H55_DG2_2DPC(SCH_1):PAGE62; CDS_LIB: c_discrete; VARIANT: ?; PCB Footprint: CTK0_SM0201_630X330_MA; ROT: 0; CDS_PART_NAME: C_RES_0201-C80792-009,RES,0,5%,0.05W,TK0,GENERIC; CDS_LOCATION: R6204
R6205 = C_RES#1: CHIPS_PART_NAME: C_RES; CDS_PHYS_PART_NAME: C_RES_0201-C80792-009,RES,0,5%,0.05W,TK0,GENERIC; CDS_LMAN_SYM_OUTLINE: -50,50,50,-50; FP_TECH: TK0; IP: GENERIC; ROOM: NONE; OriginalSymbolOrigin: (-75,25); XY: (1075,3200); VER: 1; PHYS_PAGE: 62; LOCATION: R6205; DRAWING: @RVP1_ADL_SB_ADP_S_DDR5_SODIMM_2DPC_LIB.H55_DG2_2DPC(SCH_1):PAGE62; CDS_LIB: c_discrete; VARIANT: ?; PCB Footprint: CTK0_SM0201_630X330_MA; ROT: 0; CDS_PART_NAME: C_RES_0201-C80792-009,RES,0,5%,0.05W,TK0,GENERIC; CDS_LOCATION: R6205
R6206 = C_RES#1: CHIPS_PART_NAME: C_RES; CDS_PHYS_PART_NAME: C_RES_0201-C80792-009,RES,0,5%,0.05W,TK0,GENERIC; CDS_LMAN_SYM_OUTLINE: -50,50,50,-50; FP_TECH: TK0; IP: GENERIC; ROOM: NONE; OriginalSymbolOrigin: (-75,25); XY: (1075,2775); VER: 1; PHYS_PAGE: 62; LOCATION: R6206; DRAWING: @RVP1_ADL_SB_ADP_S_DDR5_SODIMM_2DPC_LIB.H55_DG2_2DPC(SCH_1):PAGE62; CDS_LIB: c_discrete; VARIANT: ?; PCB Footprint: CTK0_SM0201_630X330_MA; ROT: 0; CDS_PART_NAME: C_RES_0201-C80792-009,RES,0,5%,0.05W,TK0,GENERIC; CDS_LOCATION: R6206
R6207 = C_RES#1: CHIPS_PART_NAME: C_RES; CDS_PHYS_PART_NAME: C_RES_0201-C80792-009,RES,0,5%,0.05W,TK0,GENERIC; CDS_LMAN_SYM_OUTLINE: -50,50,50,-50; FP_TECH: TK0; IP: GENERIC; ROOM: NONE; OriginalSymbolOrigin: (-75,25); XY: (1075,2075); VER: 1; PHYS_PAGE: 62; LOCATION: R6207; DRAWING: @RVP1_ADL_SB_ADP_S_DDR5_SODIMM_2DPC_LIB.H55_DG2_2DPC(SCH_1):PAGE62; CDS_LIB: c_discrete; VARIANT: ?; PCB Footprint: CTK0_SM0201_630X330_MA; ROT: 0; CDS_PART_NAME: C_RES_0201-C80792-009,RES,0,5%,0.05W,TK0,GENERIC; CDS_LOCATION: R6207
R6208 = C_RES#1: CHIPS_PART_NAME: C_RES; CDS_PHYS_PART_NAME: C_RES_0201-C80792-009,RES,0,5%,0.05W,TK0,GENERIC; CDS_LMAN_SYM_OUTLINE: -50,50,50,-50; FP_TECH: TK0; IP: GENERIC; ROOM: NONE; OriginalSymbolOrigin: (-75,25); XY: (1075,950); VER: 1; PHYS_PAGE: 62; LOCATION: R6208; DRAWING: @RVP1_ADL_SB_ADP_S_DDR5_SODIMM_2DPC_LIB.H55_DG2_2DPC(SCH_1):PAGE62; CDS_LIB: c_discrete; VARIANT: ?; PCB Footprint: CTK0_SM0201_630X330_MA; ROT: 0; CDS_PART_NAME: C_RES_0201-C80792-009,RES,0,5%,0.05W,TK0,GENERIC; CDS_LOCATION: R6208
R6209 = C_RES#1: CHIPS_PART_NAME: C_RES; CDS_PHYS_PART_NAME: C_RES_0201-C80792-009,RES,0,5%,0.05W,TK0,GENERIC; CDS_LMAN_SYM_OUTLINE: -50,50,50,-50; FP_TECH: TK0; IP: GENERIC; ROOM: NONE; OriginalSymbolOrigin: (-75,25); XY: (1125,500); VER: 1; PHYS_PAGE: 62; LOCATION: R6209; DRAWING: @RVP1_ADL_SB_ADP_S_DDR5_SODIMM_2DPC_LIB.H55_DG2_2DPC(SCH_1):PAGE62; CDS_LIB: c_discrete; VARIANT: ?; PCB Footprint: CTK0_SM0201_630X330_MA; ROT: 0; CDS_PART_NAME: C_RES_0201-C80792-009,RES,0,5%,0.05W,TK0,GENERIC; CDS_LOCATION: R6209
R6210 = C_RES#1: CHIPS_PART_NAME: C_RES; CDS_PHYS_PART_NAME: C_RES_0201-C80792-009,RES,0,5%,0.05W,TK0,GENERIC; CDS_LMAN_SYM_OUTLINE: -50,50,50,-50; FP_TECH: TK0; IP: GENERIC; ROOM: NONE; OriginalSymbolOrigin: (-75,25); XY: (1150,-200); VER: 1; PHYS_PAGE: 62; LOCATION: R6210; DRAWING: @RVP1_ADL_SB_ADP_S_DDR5_SODIMM_2DPC_LIB.H55_DG2_2DPC(SCH_1):PAGE62; CDS_LIB: c_discrete; VARIANT: ?; PCB Footprint: CTK0_SM0201_630X330_MA; ROT: 0; CDS_PART_NAME: C_RES_0201-C80792-009,RES,0,5%,0.05W,TK0,GENERIC; CDS_LOCATION: R6210